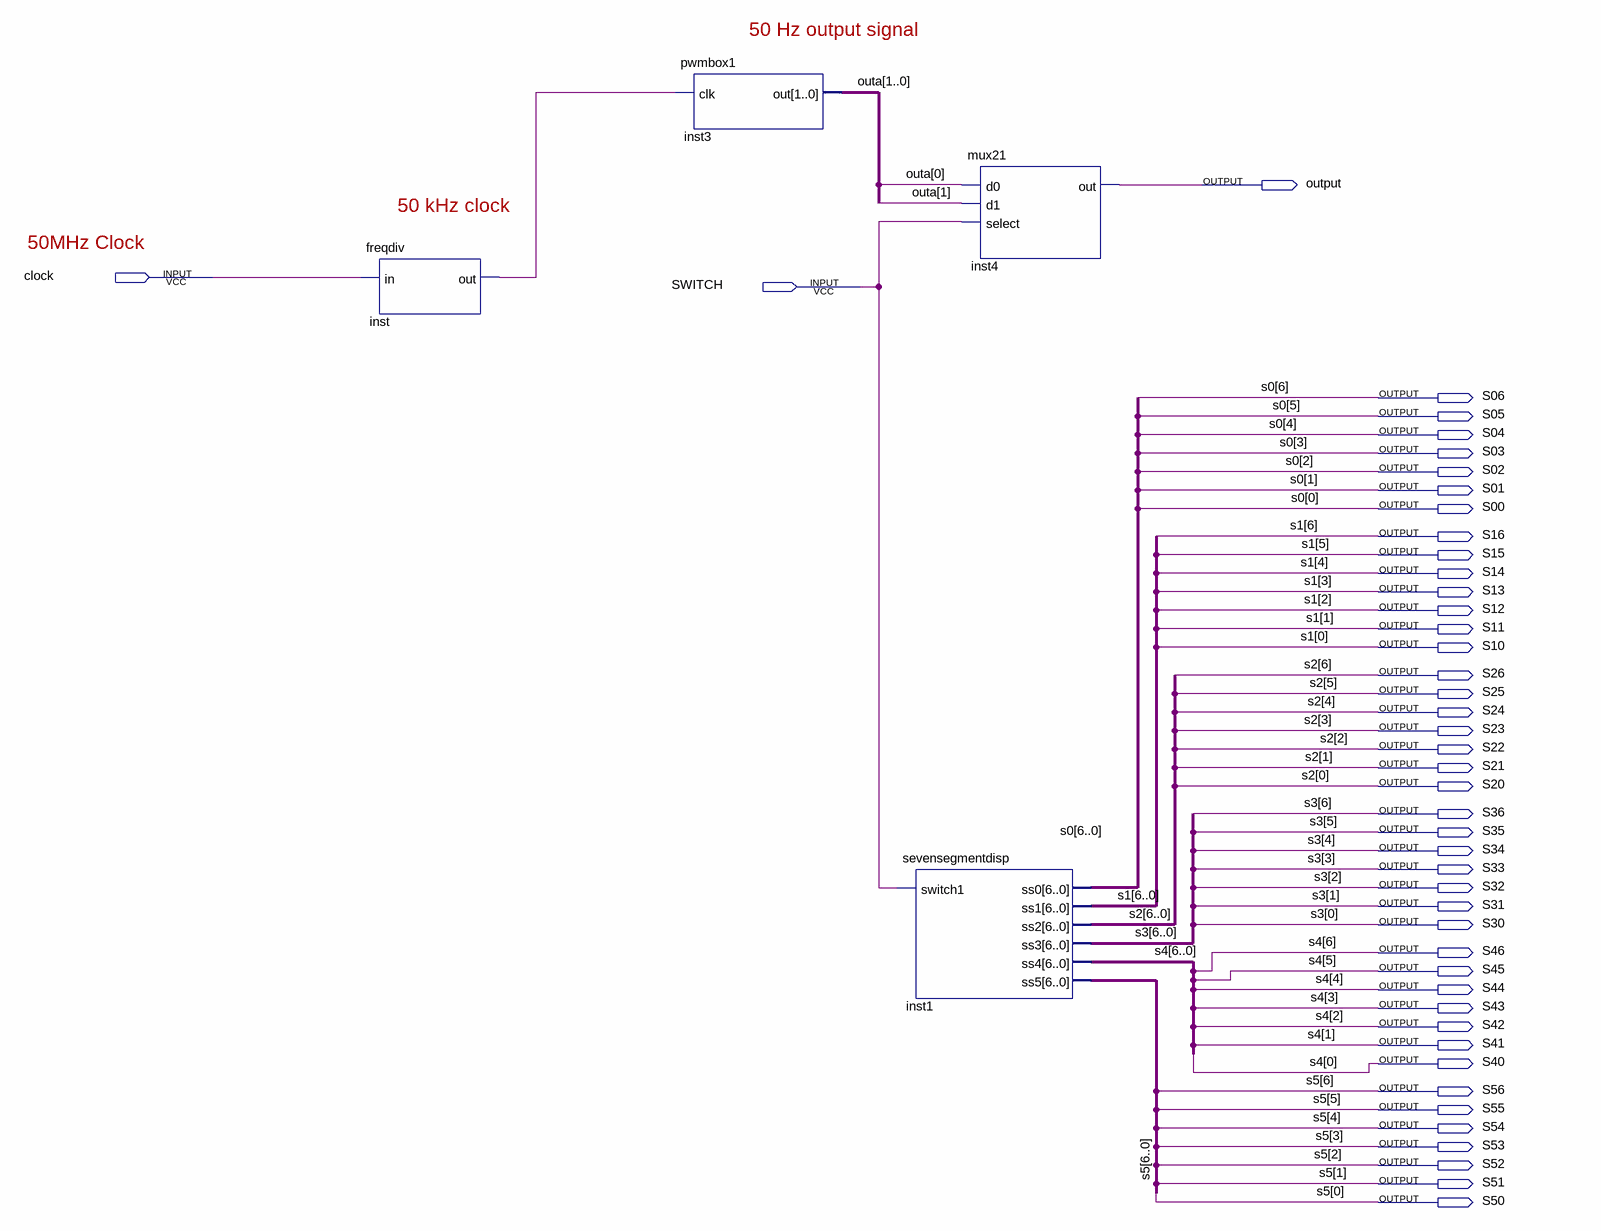
[diagram p0: schematic sheet]
// Quartus schematic boxingday.bdf as structural Verilog: 4 symbols, 45 pins
module boxingday (
  input  clock,
  input  SWITCH,
  output \output ,
  output S06,
  output S05,
  output S04,
  output S03,
  output S02,
  output S01,
  output S00,
  output S16,
  output S15,
  output S14,
  output S13,
  output S12,
  output S11,
  output S10,
  output S26,
  output S25,
  output S24,
  output S23,
  output S22,
  output S21,
  output S20,
  output S36,
  output S35,
  output S34,
  output S33,
  output S32,
  output S31,
  output S30,
  output S46,
  output S45,
  output S44,
  output S43,
  output S42,
  output S41,
  output S40,
  output S56,
  output S55,
  output S54,
  output S53,
  output S52,
  output S51,
  output S50
);

  wire inst_out;
  wire [1:0] outa;

  freqdiv inst (.in(clock), .out(inst_out));
  pwmbox1 inst3 (.clk(inst_out), .out(outa));
  sevensegmentdisp inst1 (
    .switch1(SWITCH), .ss0({S06, S05, S04, S03, S02, S01, S00}), .ss1({S16, S15, S14, S13, S12, S11, S10}),
    .ss2({S26, S25, S24, S23, S22, S21, S20}), .ss3({S36, S35, S34, S33, S32, S31, S30}),
    .ss4({S46, S45, S44, S43, S42, S41, S40}), .ss5({S56, S55, S54, S53, S52, S51, S50}));
  mux21 inst4 (.d0(outa[0]), .d1(outa[1]), .select(SWITCH), .out(\output ));

  // Notes on the sheet:
  //   50 Hz output signal
  //   50 kHz clock
  //   50MHz Clock
endmodule
